# EAGLE design moe_tuned_lens (EAGLE 9.6.2)
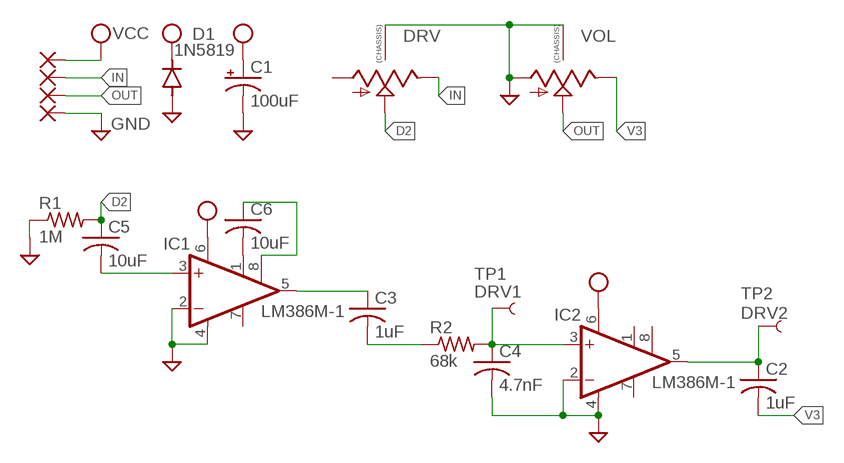
[diagram p0: schematic, sheet 1]

## Parts
C1  100uF  100UF-POLAR-RADIAL-2.5MM-25V-20%  [CPOL-RADIAL-2.5MM-6.5MM]
C2  1uF  C-USC0805  [C0805]
C3  1uF  C-USC0805  [C0805]
C4  4.7nF  C-USC0805  [C0805]
C5  10uF  C-USC1206  [C1206]
C6  10uF  C-USC1206  [C1206]
D1  1N5819  DIODE-SOD123  [SOD123]
DRV  9MM_SNAP-IN_POT_CHASSIS  [9MM_SNAP-IN_POT]
IC1  LM386M-1  [SO08]
IC2  LM386M-1  [SO08]
PAD1  1,6/0,8  [1,6/0,8]
PAD2  1,6/0,8  [1,6/0,8]
PAD3  1,6/0,8  [1,6/0,8]
PAD4  1,6/0,8  [1,6/0,8]
R1  1M  R-US_R0805  [R0805]
R2  68k  R-US_R0805  [R0805]
TP1  DRV1  TEST-POINT3  [PAD.03X.03]
TP2  DRV2  TEST-POINT3  [PAD.03X.03]
VOL  9MM_SNAP-IN_POT_CHASSIS  [9MM_SNAP-IN_POT]

## Nets
D2: C5.1 DRV.2(S) R1.2
GND: C1.2(-) C4.2 D1.A DRV.CHASSIS1 DRV.CHASSIS2 IC1.2(-IN) IC1.4(GND) IC2.2(-IN) IC2.4(GND) PAD4.1(P) R1.1 VOL.1(A) VOL.CHASSIS1 VOL.CHASSIS2
IN: DRV.3(E) PAD2.1(P)
N$1: C5.2 IC1.3(+IN)
N$2: C6.2 IC1.1(GAIN)
N$3: C6.1 IC1.8(GAIN)
N$4: C3.1 IC1.5(OUT)
N$5: C3.2 R2.1
N$6: C4.1 IC2.3(+IN) R2.2 TP1.P$1
N$7: C2.1 IC2.5(OUT) TP2.P$1
OUT: PAD3.1(P) VOL.2(S)
V3: C2.2 VOL.3(E)
VCC: C1.1(+) D1.C IC1.6(VS) IC2.6(VS) PAD1.1(P)
Unconnected: DRV.1(A) IC1.7(BYPASS) IC2.1(GAIN) IC2.7(BYPASS) IC2.8(GAIN)

## Library data of the parts
C1 = SparkFun-Capacitors:100UF-POLAR: 100µF polarized capacitors A capacitor is a passive two-terminal electrical component used to store electrical energy temporarily in an electric field.; PROD_ID: CAP-08439
C2-C6 = adafruit:C-US: CAPACITOR, American symbol
D1 = diode:DIODE-: DIODE
DRV VOL = MusicThingModular:9MM_SNAP-IN_POT_CHASSIS: 9mm vertical snap-in pot, Alpha / Panasonic style, with a connection to the metal chassis for grounding
IC1 IC2 = linear:LM386?-*: Low Voltage Audio Power Amplifier Source: http://cache.national.com/ds/LM/LM386.pdf
PAD1-PAD4 = wirepad:1,6/0,8: THROUGH-HOLE PAD
R1 R2 = adafruit:R-US_: RESISTOR, American symbol
TP1 TP2 = SparkFun-Connectors:TEST-POINT: SparkFun Test Points Bare copper test points for troubleshooting or In-Circuit-Testing. These are used by our Production team for verifying production board runs using pogo-pins on test beds. SparkFun Products: SparkFun LSM9DS1 Breakout <https://www.sparkfun.com/products/13284> SparkFun PSOC <https://www.sparkfun.com/products/13714> SparkFun Load Cell Amplifier <https://www.sparkfun.com/products/13879>

## Board
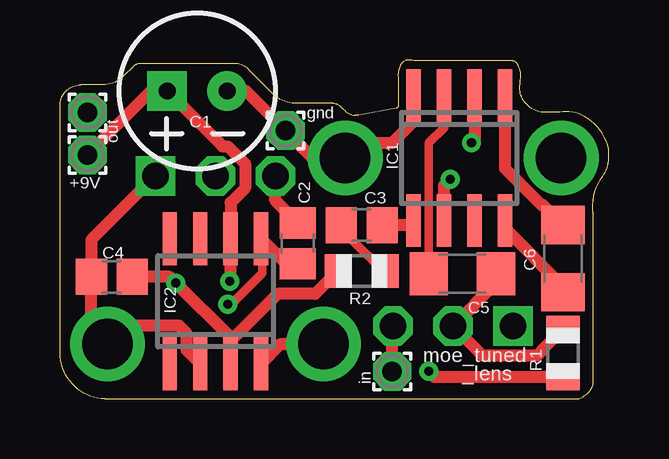
[diagram p1: board, top side]
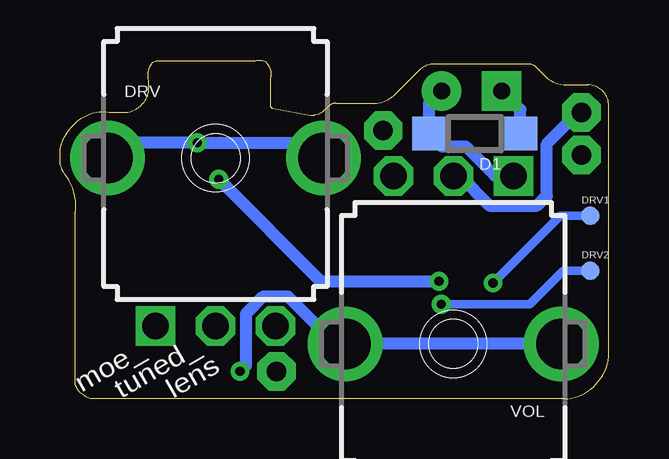
[diagram p2: board, bottom side, seen from below]

Size 22.87 x 14.12 mm. Coordinates in mm from the lower left corner, seen from the top.
Outline: 1.86,0 21.41,0 arc45 21.84,0.13 arc45 22.23,0.62 22.23,7.72 arc-45 22.61,9.27 arc45 22.86,10.12 22.86,10.41 arc45 21.97,11.69 arc45 20.82,11.94 20.04,11.94 arc-45 19.3,12.45 arc-45 19.18,13.12 19.18,13.29 arc45 19.05,13.97 arc45 18.74,14.1 14.73,14.1 arc45 14.3,14.05 14.22,13.97 arc45 14.1,13.36 14.1,12.2 arc-45 14.01,12.11 12.45,11.81 arc-45 12.39,11.81 12.3,11.81 arc-45 11.76,12.12 11.68,12.2 arc45 11.38,12.32 9.78,12.32 arc-45 8.91,12.68 7.87,13.72 arc45 7.26,13.97 3.35,13.97 arc45 3.05,13.85 2.65,13.44 arc-45 1.78,13.08 0.87,13.08 arc45 0.25,12.83 arc45 0,12.22 0,1.91 arc45 0.54,0.61 0.64,0.51 arc45 1.86,0
Copper layers (1*16): Top 0.035mm / dielectric 1.5mm / Bottom 0.035mm
Design rules "default *": minimum track width 6mil, minimum drill 0.35mm, track to track 6mil, track to pad 6mil, pad to pad 6mil, via to via 6mil, smd to smd 6mil, copper to edge 10mil, drill to drill 6mil, minimum pad ring 10mil, minimum via ring 8mil, stop-mask expansion 4mil, vias tented up to drill 0mil, thermal gap 10mil

### Footprints (pad centres in the part's own frame; a part is rotated, then mirrored left to right if it is on the bottom)
CPOL-RADIAL-2.5MM-6.5MM = drill 0.7 pad 1.651 square: 1 1.25,0 | drill 0.7 pad 1.651: 2 -1.25,0
C0805 = smd 1.3 x 1.5: 1 -0.85,0; 2 0.85,0
C1206 = smd 1.6 x 1.8: 1 -1.4,0; 2 1.4,0
SOD123 = smd 1.4 x 1.4: A 1.9,0; C -1.9,0
9MM_SNAP-IN_POT = drill 1.1 square: 1 -2.5,-7 | drill 1.1 octagon: 2 0,-7; 3 2.5,-7 | drill 2.1 pad 2.794: CHASSIS1 -4.5,0; CHASSIS2 4.5,0
SO08 = smd 0.6 x 2.2: 1 -1.905,-2.6; 2 -0.635,-2.6; 3 0.635,-2.6; 4 1.905,-2.6; 5 1.905,2.6; 6 0.635,2.6; 7 -0.635,2.6; 8 -1.905,2.6
1,6/0,8 = drill 0.813 pad 1.6 octagon: 1 0,0
R0805 = smd 1.1 x 1.4: 1 -1,0; 2 1,0
PAD.03X.03 = smd 0.762 x 0.762: P$1 0,0

### Placement (x,y rotation side)
C1  5.71,12.83 180 top
C2  9.91,6.48 90 top
C3  12.57,7.24 180 top
C4  2.16,5.08 180 top
C5  16.76,5.21 180 top
C6  20.95,5.85 90 top
D1  5.59,11.05 180 bottom
DRV  16.38,10.04 0 bottom
IC1  16.64,10.04 180 top
IC2  6.48,4.07 0 top
PAD1  1.14,10.16 0 top
PAD2  13.84,1.15 0 top
PAD3  1.14,11.94 0 top
PAD4  9.4,11.18 0 top
R1  20.95,1.91 90 top
R2  12.57,5.34 180 top
TP1  0.76,7.62 0 bottom
TP2  0.76,5.34 0 bottom
VOL  6.48,2.29 180 bottom

### Tracks (layer width: path | path; a pad name or v marks a point on that pad's centre or on a via)
D2
  Top 0.508: C5.1 18.16,4.82 DRV.2 17.61,1.81 19.88,1.81 20.11,2.04 20.11,2.07 R1.2
GND  (via drill 0.38)
  Top 0.508: IC2.2 5.28,2.03 5.28,2.74 4.96,3.05 2.67,3.05 1.98,2.36 VOL.CHASSIS1 1.31,2.96 C4.2 1.31,6.62 VOL.1 | IC2.4 9.2,2.29 VOL.CHASSIS2 | IC1.4 14.73,11.56 13.84,10.67 12.52,10.67 DRV.CHASSIS2 10.54,10.04 PAD4.1 7.75,12.83 C1.2 | IC1.2 17.27,10.8 v17.14,10.67 | R1.1 15.61,0.91 v15.37,1.15
  Bottom 0.508: DRV.CHASSIS1 20.25,10.67 v17.14,10.67 12.52,10.67 DRV.CHASSIS2 | v15.37,1.15 15.11,1.4 15.11,3.55 14.39,4.27 13.37,4.27 11.39,2.29 VOL.CHASSIS2 VOL.CHASSIS1 | C1.2 7.49,12.31 D1.A 6.96,10.52 5.97,10.52 4.74,9.29 VOL.1
IN
  Top 0.508: PAD2.1 13.84,3 DRV.3
N$1
  Top 0.356: C5.2 15.36,10.67 16,11.31 IC1.3
N$2
  Top 0.508: C6.2 20.13,8.07 20.07,8.07 18.54,9.6 IC1.1
N$3
  Top 0.508: C6.1 20.95,4.69 18.54,7.11 IC1.8
N$4
  Top 0.508: IC1.5 14.54,7.24 C3.1
N$5
  Top 0.356: R2.1 13.46,5.34 12.06,6.74 12.06,6.9 C3.2
N$6  (via drill 0.38)
  Top 0.508: 7.11,2.42 IC2.3 | R2.2 10.63,4.38 9.08,4.38 7.11,2.42 | 7.11,2.42 7.11,2.54 v4.83,4.83 4.57,5.08 C4.1
  Bottom 0.356: TP1.P$1 2.03,7.62 v4.83,4.83
N$7  (via drill 0.38)
  Top 0.356: v6.99,3.94 7,3.93 7.12,3.93 8.43,5.24 8.43,6.62 IC2.5
  Top 0.508: IC2.5 9.42,5.63 C2.1
  Bottom 0.356: v6.99,3.94 3.3,3.94 1.91,5.34 TP2.P$1
OUT
  Bottom 0.508: PAD3.1 1.27,11.94 2.58,10.63 2.58,8.46 2.98,8.06 4.97,8.06 6.2,9.29 VOL.2
V3
  Top 0.508: C2.2 8.98,8.26 VOL.3
VCC  (via drill 0.38)
  Top 0.508: v7.07,4.91 7.11,4.95 IC2.6 7.11,8.18 7.71,8.78 7.71,9.8 6.99,10.52 6.78,10.52 C1.1 3.81,12.83 PAD1.1 | IC1.6 16,8.89 v16.26,9.15
  Bottom 0.508: v16.26,9.15 12.02,4.91 v7.07,4.91 | D1.C 3.69,12.05 C1.1

### Text on the board
tPlace: gnd | out | +9V | moe_tuned | in | _lens
bPlace: DRV1 | DRV2 | lens | tuned_ | moe_